# Altium schematic sheet Sheet2.SchDoc
size A4; SheetNumber: 1; SheetTotal: 1
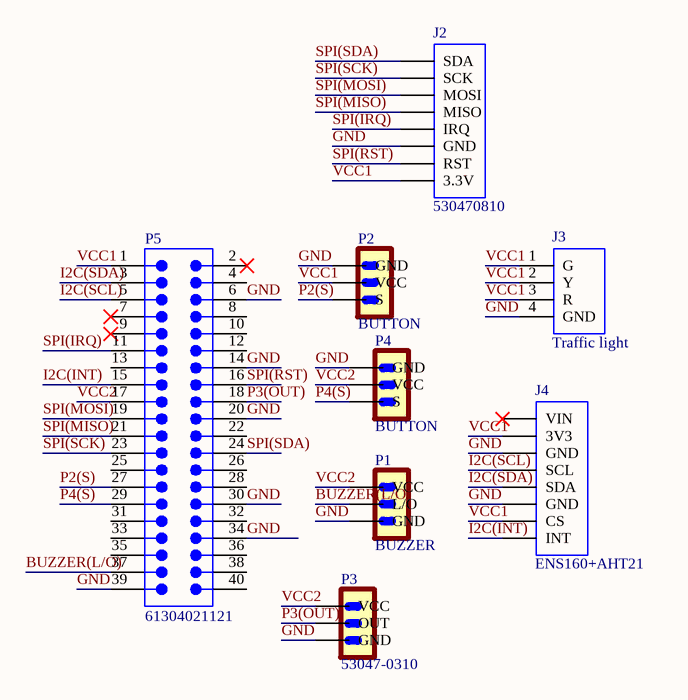
[diagram p0: Sheet2.SchDoc]

## Parts
J2  530470810  [SPI]
J3  Traffic light  [Traffic light]
J4  ENS160+AHT21  [ENS160+AHT21]
P1  BUZZER  [BUZZER]
P2  BUTTON  [Button]
P3  53047-0310  [SR505]
P4  BUTTON  [Button2]
P5  61304021121  [61304021121]

## Nets
BUZZER(L/O): P1.2(L/O) P5.37
GND: J2.6(GND) J3.4(GND) J4.3(GND) P1.1(GND) P2.41(GND) P3.1(GND) P4.44(GND) P5.6 P5.14 P5.20 P5.30 P5.34 P5.39
I2C(INT): J4.8(INT) P5.15
I2C(SCL): J4.4(SCL) P5.5
I2C(SDA): J4.5(SDA) P5.3
P2(S): P2.42(S) P5.27
P3(OUT): P3.2(OUT) P5.18
P4(S): P4.45(S) P5.29
SPI(IRQ): J2.5(IRQ) P5.11
SPI(MISO): J2.4(MISO) P5.21
SPI(MOSI): J2.3(MOSI) P5.19
SPI(RST): J2.7(RST) P5.16
SPI(SCK): J2.2(SCK) P5.23
SPI(SDA): J2.1(SDA) P5.24
VCC1: J2.8(3.3V) J3.1(G) J3.2(Y) J3.3(R) J4.2(3V3) J4.7(CS) P2.43(VCC) P5.1
VCC2: P1.3(VCC) P3.3(VCC) P4.46(VCC) P5.17

Not connected (* = marked no-connect by the designer): J4 1(VIN)*; P5 2* 4 7* 8 9* 10 12 13 22 25 26 28 31 32 33 35 36 38 40

## Library data of the parts
J3 = Traffic light: 2.50mm Pitch SPOXâ„¢ Wire-to-Board Header, Vertical, Shrouded, 4 Circuits, Tin (Sn) Plating; MF: Molex; MP: 22035045; SnapEDA_Link: https://www.snapeda.com/parts/22035045/Molex/view-part/?ref=snap; Package: None; Value: *; Check_prices: https://www.snapeda.com/parts/22035045/Molex/view-part/?ref=eda
J4 = ENS160+AHT21: MP: 530470810; Package: None; Price: None; Value: *; Availability: Unavailable
P1 = BUZZER: Connector Header Through Hole 3 position 0.049 (1.25mm); MF: Molex; MP: 53047-0310; Package: None; Price: None; Value: *; SnapEDA_Link: https://www.snapeda.com/parts/53047-0310/Molex/view-part/?ref=snap; Availability: In Stock; Check_prices: https://www.snapeda.com/parts/53047-0310/Molex/view-part/?ref=eda
P2 P4 = BUTTON: Connector Header Through Hole 3 position 0.049 (1.25mm); MF: Molex; MP: 53047-0310; Package: None; Price: None; Value: *; SnapEDA_Link: https://www.snapeda.com/parts/53047-0310/Molex/view-part/?ref=snap; Availability: In Stock; Check_prices: https://www.snapeda.com/parts/53047-0310/Molex/view-part/?ref=eda
P3 = 53047-0310: Connector Header Through Hole 3 position 0.049 (1.25mm); MF: Molex; Package: None; Price: None; SnapEDA_Link: https://www.snapeda.com/parts/53047-0310/Molex/view-part/?ref=snap; MP: 53047-0310; Availability: In Stock; Check_prices: https://www.snapeda.com/parts/53047-0310/Molex/view-part/?ref=eda
P5 = CMP-1502-01135-4: WR-PHD Straight Male, PCB Header, Through Hole, 2 Rows, 40 Contacts, 2.54mm Pitch; Number of Positions: 40; Contact Resistance: 20mΩ; Connector Type: Male Pin; Voltage Rating: 250V; Current Rating: 3A; Color: Black; Number of Pins: 40; Orientation: Vertical; Number of Rows: 2; Number of Contacts: 40; Gender: Male; Contact Plating: Gold; Pitch: 2.54mm; Contact Material: Gold; RoHS: Compliant; Min Operating Temperature: -40°C; Operating Supply Voltage: 250V; Row Spacing: 2.54mm; Contact Mating Length: 5.9944mm; Packaging: Bulk; Lead Pitch: 2.54mm; Height: 8.89mm; Max Operating Temperature: 105°C; Mount: Through Hole; Termination: Solder
J2 = 530470810: Package: None; Price: None; Value: *; MP: 530470810; Availability: Unavailable